# EAGLE design SerLCD (EAGLE 6.2)
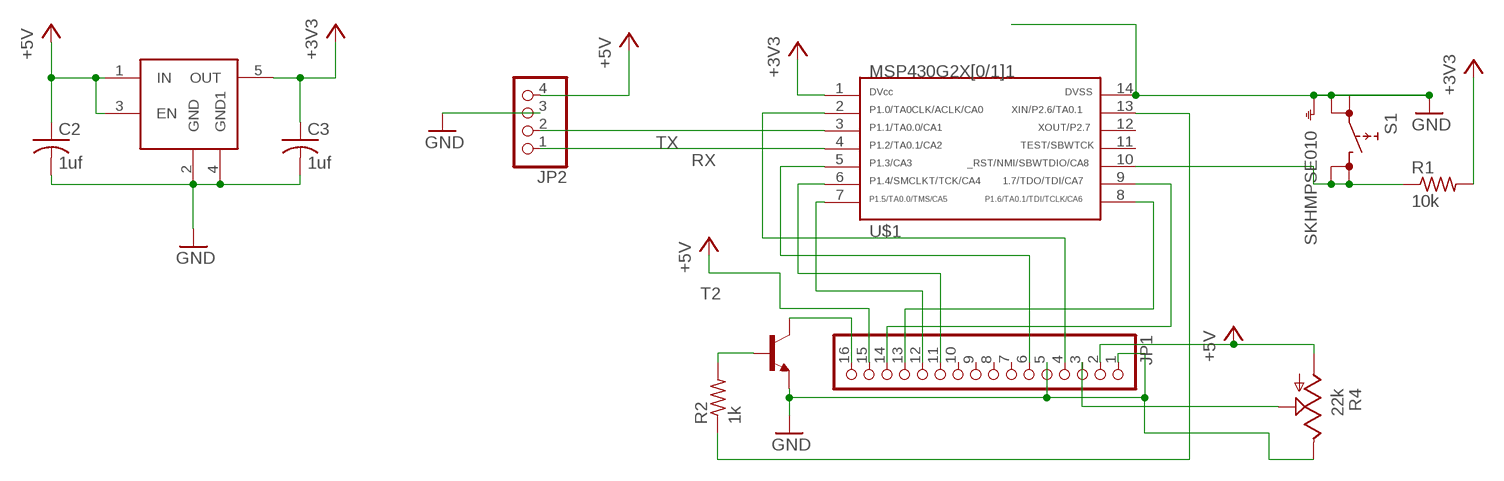
[diagram p0: schematic, sheet 1]

## Parts
C2  1uf  C-US025-025X050  [C025-025X050]
C3  1uf  C-US025-025X050  [C025-025X050]
JP1  PINHD-1X16  [1X16]
JP2  PINHD-1X4  [1X04]
R1  10k  R-US_0207/10  [0207/10]
R2  1k  R-US_0207/10  [0207/10]
R4  22k  TRIM_US-CA6H  [CA6H]
S1  SKHMPSE010  [SKHMPXE010]
T2  -NPN-TO92-EBC  [TO92-EBC]
U$1  G2X[0/1]1---N14  [N14]
U$2  TPS783XX  [DBV-R-PDSO-G5]

## Nets
+3V3: C3.1 R1.2 U$1.1 U$2.5(OUT)
+5V: C2.1 JP1.2 JP1.15 JP2.4 R4.A U$2.1(IN) U$2.3(EN)
GND: C2.2 C3.2 JP1.1 JP1.5 JP2.3 R4.E S1.1(1.1) S1.2(1.2) S1.5(SH) T2.E U$1.14 U$2.2(GND) U$2.4(GND1)
N$1: JP1.4 U$1.2
N$2: JP1.6 U$1.5
N$3: JP1.11 U$1.6
N$4: JP1.12 U$1.7
N$5: JP1.13 U$1.8
N$6: JP1.14 U$1.9
N$7: R1.1 S1.3(2.1) S1.4(2.2) U$1.10
N$8: JP1.16 T2.C
N$9: R2.2 T2.B
N$10: R2.1 U$1.13
N$15: JP1.3 R4.S
RX: JP2.1 U$1.4
TX: JP2.2 U$1.3
Unconnected: JP1.7 JP1.8 JP1.9 JP1.10 U$1.11 U$1.12

## Library data of the parts
C2 C3 = resistor:C-US: CAPACITOR, American symbol
JP1 = pinhead:PINHD-1X16: PIN HEADER
JP2 = pinhead:PINHD-1X4: PIN HEADER
R1 R2 = resistor:R-US_: RESISTOR, American symbol
R4 = pot:TRIM_US-: POTENTIOMETER
S1 = switch:SKHMP*E010: 6.2 X 6.5mm TACT Switch (SMD) Source: http://www3.alps.co.jp/WebObjects/catalog.woa/PDF/E/Switch/Tact/SKHM/SKHM.PDF
T2 = transistor:*-NPN-: NPN Transistror BF959 corrected 2008.03.06
U$1 = TI_MSP430_v16:G2X[0/1]1---N14: MSP430G2X[0/1]1 MSP430G2001, MSP430G2101, MSP430G2201,MSP430G2111, G2211 PDIP (N) 14 Pin Package http://focus.ti.com/docs/prod/folders/print/msp430g2111.html
U$2 = RobThePyro:TPS783XX

## Board
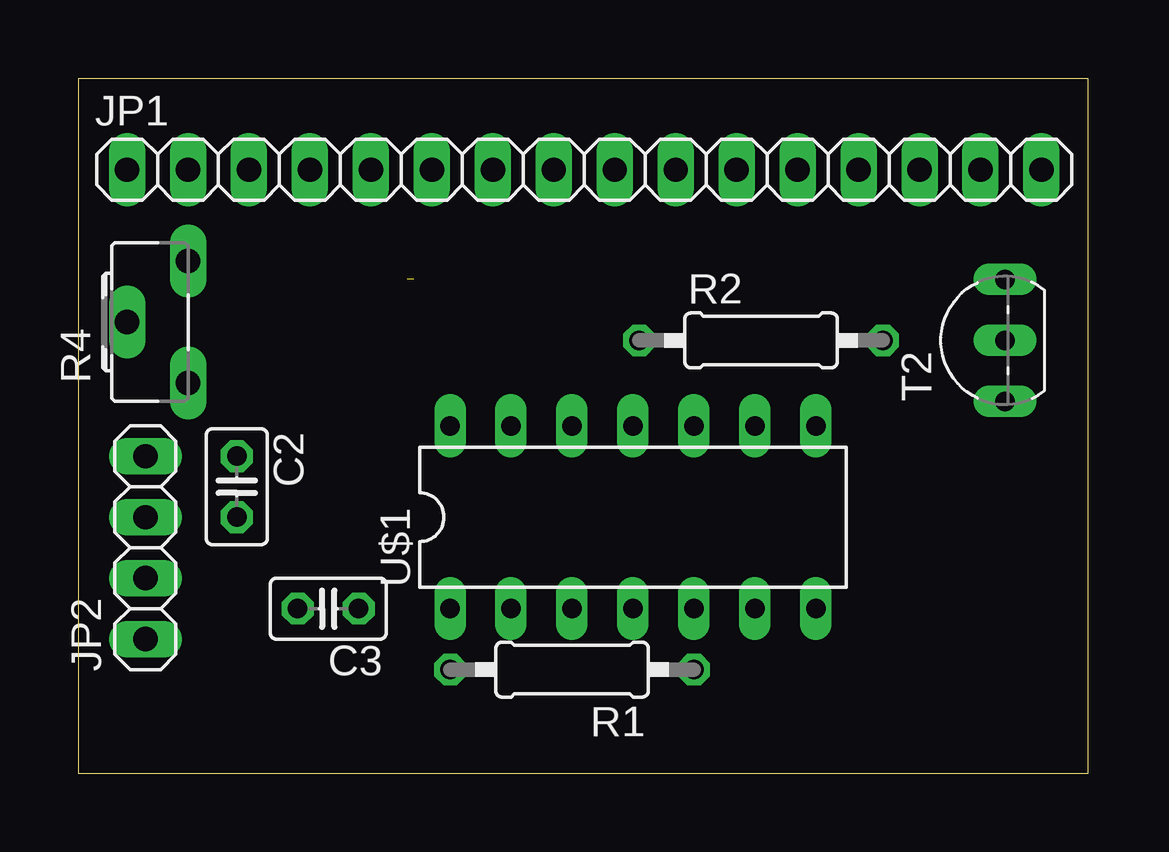
[diagram p1: board, top side]
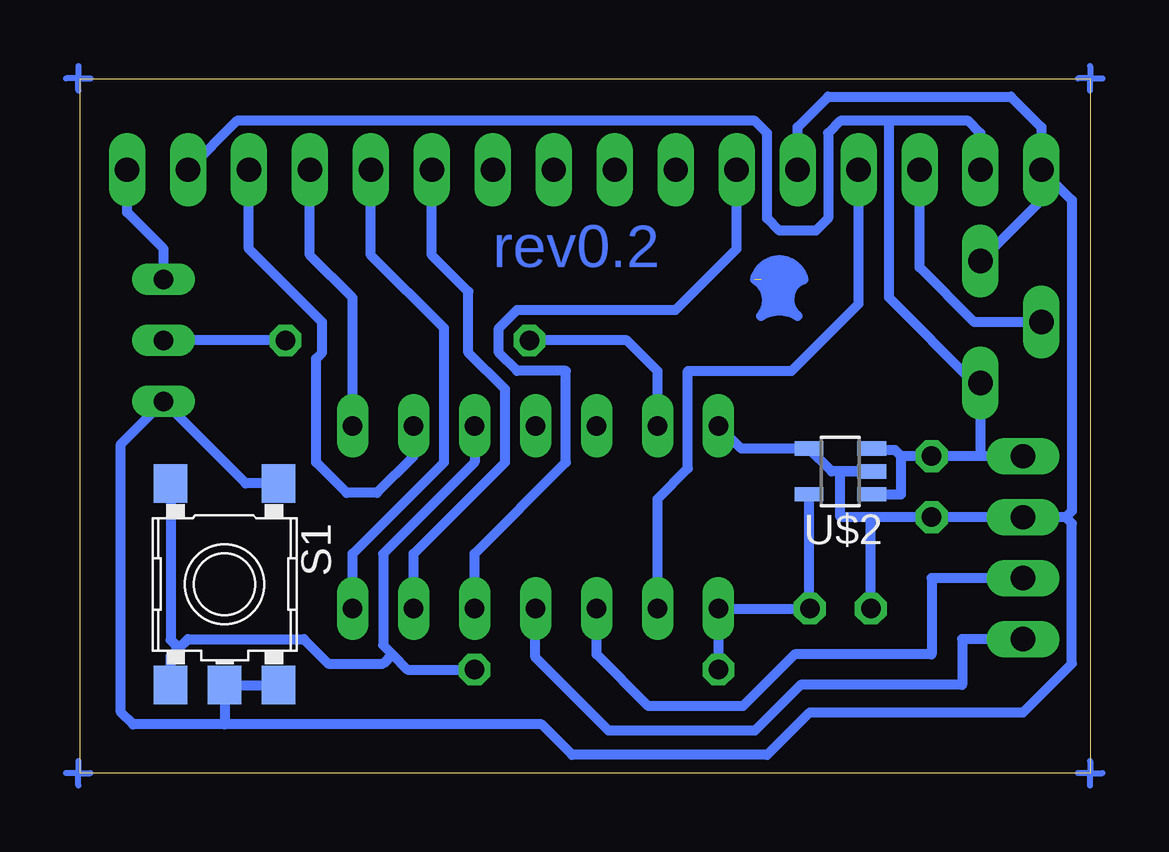
[diagram p2: board, bottom side, seen from below]

Size 42.09 x 28.95 mm. Coordinates in mm from the lower left corner, seen from the top.
Outline: 0,0 42.09,0 42.09,28.95 0,28.95 0,0
Copper layers (1*16): Top 0.035mm / dielectric 1.5mm / Bottom 0.035mm
Design rules: minimum track width 10mil, minimum drill 24mil, track to track 8mil, track to pad 8mil, pad to pad 8mil, via to via 8mil, smd to smd 8mil, copper to edge 40mil, drill to drill 8mil, minimum pad ring 10mil, minimum via ring 8mil, stop-mask expansion 4mil, vias tented up to drill 0mil, thermal gap 10mil

### Footprints (pad centres in the part's own frame; a part is rotated, then mirrored left to right if it is on the bottom)
C025-025X050 = drill 0.813 octagon: 1 -1.27,0; 2 1.27,0
1X16 = drill 1.016 long: 1 -19.05,0; 2 -16.51,0; 3 -13.97,0; 4 -11.43,0; 5 -8.89,0; 6 -6.35,0; 7 -3.81,0; 8 -1.27,0; 9 1.27,0; 10 3.81,0; 11 6.35,0; 12 8.89,0; 13 11.43,0; 14 13.97,0; 15 16.51,0; 16 19.05,0
1X04 = drill 1.016 long: 1 -3.81,0; 2 -1.27,0; 3 1.27,0; 4 3.81,0
0207/10 = drill 0.813 octagon: 1 -5.08,0; 2 5.08,0
CA6H = drill 1.016 long: A -2.54,0; E 2.54,0; S 0,2.54
SKHMPXE010 = smd 1.6 x 1.4: 1 -4.2,2.25; 2 4.2,2.25; 3 -4.2,-2.25; 4 4.2,-2.25; 5 4.2,0
TO92-EBC = drill 0.813 long: B 0,-1.27; C 2.54,-1.27; E -2.54,-1.27
N14 = drill 0.813 long: 1 -7.625,-3.81; 2 -5.085,-3.81; 3 -2.545,-3.81; 4 -0.005,-3.81; 5 2.535,-3.81; 6 5.075,-3.81; 7 7.615,-3.81; 8 7.615,3.81; 9 5.075,3.81; 10 2.535,3.81; 11 -0.005,3.81; 12 -2.545,3.81; 13 -5.085,3.81; 14 -7.625,3.81
DBV-R-PDSO-G5 = smd 0.6 x 1.2: 1 -0.95,-1.306; 2 0,-1.306; 3 0.95,-1.306; 4 0.95,1.306; 5 -0.95,1.306

### Placement (x,y rotation side)
C2  6.6,11.94 270 top
C3  10.41,6.86 180 top
JP1  21.08,25.15 0 top
JP2  2.79,9.4 90 top
R1  20.57,4.32 180 top
R2  28.45,18.03 0 top
R4  4.57,18.8 90 top
S1  36.07,7.87 270 bottom
T2  37.34,18.03 90 top
U$1  23.11,10.67 0 top
U$2  10.41,12.57 90 bottom

### Tracks (layer width: path | path; a pad name or v marks a point on that pad's centre or on a via)
+3V3
  Bottom 0.406: U$2.5 11.72,6.89 C3.1 U$1.1 R1.2
+5V
  Bottom 0.406: JP2.4 4.57,13.21 | 4.57,13.21 C2.1 7.87,13.21 | 7.87,13.21 8.13,13.46 9.05,13.46 U$2.3 | U$2.1 7.87,11.62 7.87,13.21 | JP1.2 4.57,26.67 5.08,27.18 8.38,27.18 | JP1.15 35.56,27.18 13.97,27.18 13.46,26.67 13.46,23.11 12.95,22.61 11.43,22.61 10.92,23.11 10.92,26.67 10.41,27.18 8.38,27.18 | 4.57,13.21 R4.A 4.83,16.26 8.38,19.81 8.38,27.18
GND
  Bottom 0.406: 9.14,10.67 C2.2 JP2.3 1.02,10.67 | 9.14,10.67 10.41,10.67 10.41,12.57 U$2.2 10.77,12.57 U$2.4 14.53,13.52 U$1.14 | C3.2 9.14,10.67 | 1.02,10.67 0.76,10.92 0.76,23.88 JP1.1 | 1.02,10.67 0.76,10.41 0.76,4.57 2.79,2.54 11.68,2.54 13.46,0.76 21.59,0.76 22.86,2.03 36.07,2.03 | JP1.1 2.03,23.88 R4.E | JP1.5 12.19,26.92 10.92,28.19 3.3,28.19 2.03,26.92 JP1.1 | 36.07,2.03 39.88,2.03 40.39,2.54 40.39,13.72 T2.E 35.19,12.07 S1.1 | S1.2 S1.5 36.07,2.03
N$1
  Bottom 0.406: U$1.2 18.03,11.44 16.76,12.7 16.76,16.76 12.45,16.76 9.65,19.56 JP1.4
N$2
  Bottom 0.406: U$1.5 25.65,9.15 21.84,12.95 21.84,16.76 23.88,16.76 24.64,17.53 24.64,18.54 23.88,19.3 17.27,19.3 14.73,21.84 JP1.6
N$3
  Bottom 0.406: U$1.6 28.19,9.15 24.38,12.95 24.38,16 25.91,17.53 25.91,20.07 27.43,21.59 JP1.11
N$4
  Bottom 0.406: U$1.7 30.73,9.15 26.92,12.95 26.92,18.54 29.97,21.59 JP1.12
N$5
  Bottom 0.406: U$1.8 30.73,19.81 32.51,21.59 JP1.13
N$6
  Bottom 0.406: U$1.9 28.19,13.21 29.72,11.68 30.99,11.68 32.26,12.95 32.26,17.27 32,17.53 32,18.8 35.05,21.84 JP1.14
N$7
  Bottom 0.406: U$1.10 25.65,12.96 29.46,9.14 29.46,5.33 29.08,4.95 | 29.08,4.95 28.45,4.32 R1.1 | S1.4 38.32,4.86 37.97,5.21 | 37.97,5.21 37.59,5.59 32.77,5.59 31.75,4.57 29.46,4.57 29.08,4.95 | S1.3 38.32,5.55 37.97,5.21
N$8
  Bottom 0.406: T2.C 38.61,21.84 40.13,23.37 JP1.16
N$9
  Bottom 0.406: R2.2 T2.B
N$10
  Bottom 0.406: U$1.13 18.03,16.76 19.3,18.03 R2.1
N$11
  Bottom 0.406: 12.7,20.32 12.7,20.07 | 12.7,20.07 13.46,20.07 13.46,19.81 12.7,19.81 | 12.7,20.07 12.7,19.81 | 12.7,19.81 12.7,19.56 13.46,19.56
N$12  (1 unrouted)
  Bottom 0.406: 12.19,20.83 13.21,20.83 | 13.72,20.83 13.21,20.83 | 13.21,20.83 13.21,21.08 12.45,21.08 12.45,20.57 13.72,20.57 | 11.94,20.57 arc-152 13.97,20.57 arc100 13.72,19.05 arc67 12.19,19.05 arc125 11.94,20.57
N$13
  Bottom 0.406: 13.46,20.32 12.95,20.32
N$14
  Bottom 0.254: 0,28.45 0,28.96 | 0,29.46 0,28.96 | 0,28.96 0.51,28.96 | 0,28.96 -0.51,28.96
N$15
  Bottom 0.406: R4.S 4.83,18.8 7.11,21.08 JP1.3
N$16
  Bottom 0.254: 0,-0.51 0,0 | 0,0.51 0,0 | 0,0 0.51,0 | 0,0 -0.51,0
N$17
  Bottom 0.254: 42.16,-0.51 42.16,0 | 42.16,0.51 42.16,0 | 42.16,0 42.67,0 | 42.16,0 41.66,0
N$18
  Bottom 0.254: 42.16,28.45 42.16,28.96 | 42.16,29.46 42.16,28.96 | 42.16,28.96 42.67,28.96 | 42.16,28.96 41.66,28.96
RX
  Bottom 0.406: JP2.1 5.33,5.59 5.33,3.68 12.06,3.68 13.97,1.78 20.07,1.78 23.11,4.83 U$1.4
TX
  Bottom 0.406: JP2.2 6.6,8.13 6.6,4.95 12.32,4.95 14.48,2.79 18.41,2.79 20.57,4.95 U$1.3

### Text on the board
Bottom: rev0.2